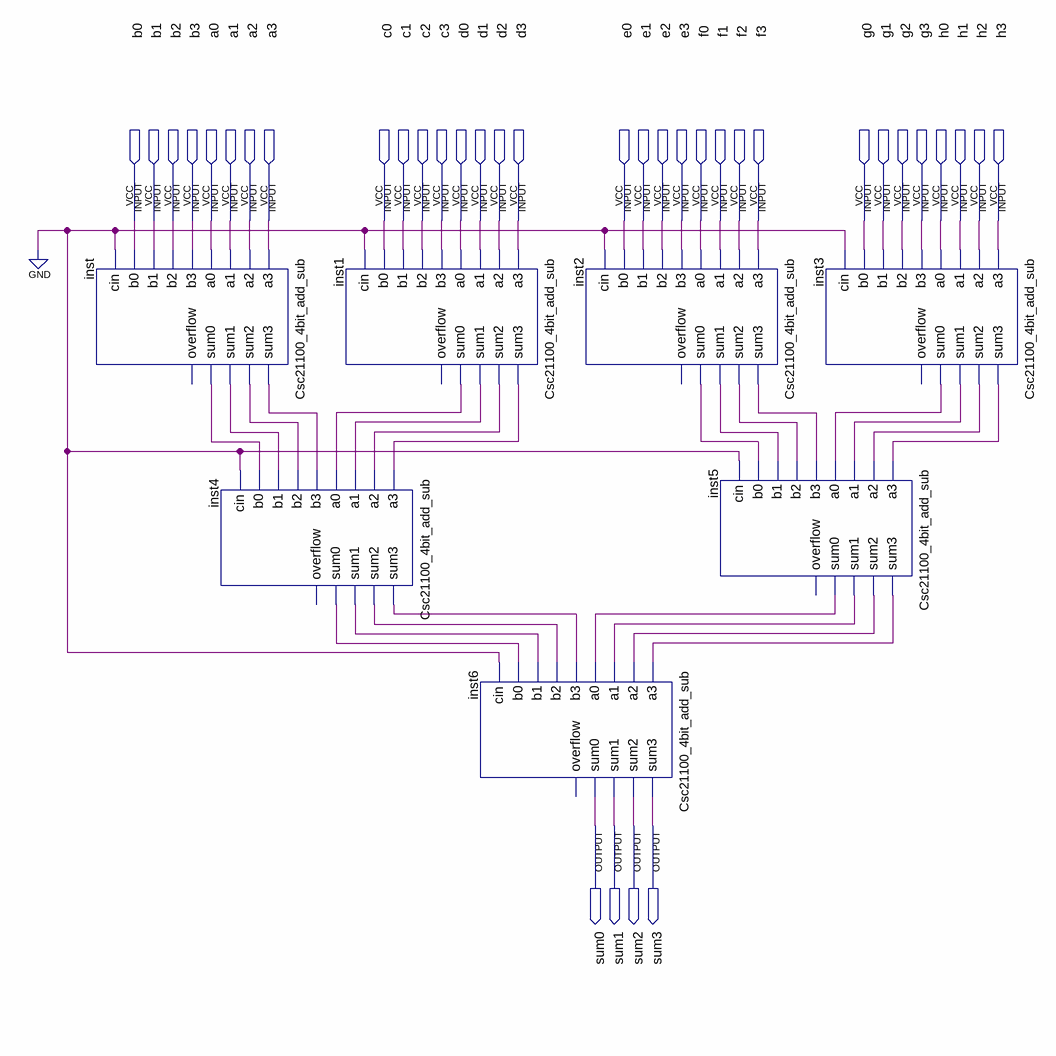
[diagram p0: schematic sheet]
// Quartus schematic Block1.bdf as structural Verilog: 7 symbols, 36 pins
module Block1 (
  input  b0,
  input  b1,
  input  b2,
  input  b3,
  input  a0,
  input  a1,
  input  a2,
  input  a3,
  input  c0,
  input  c1,
  input  c2,
  input  c3,
  input  d0,
  input  d1,
  input  d2,
  input  d3,
  input  e0,
  input  e1,
  input  e2,
  input  e3,
  input  f0,
  input  f1,
  input  f2,
  input  f3,
  input  g0,
  input  g1,
  input  g2,
  input  g3,
  input  h0,
  input  h1,
  input  h2,
  input  h3,
  output sum0,
  output sum1,
  output sum2,
  output sum3
);

  wire inst1_sum0, inst1_sum1, inst1_sum2, inst1_sum3, inst2_sum0, inst2_sum1, inst2_sum2, inst2_sum3,
       inst3_sum0, inst3_sum1, inst3_sum2, inst3_sum3, inst4_sum0, inst4_sum1, inst4_sum2, inst4_sum3,
       inst5_sum0, inst5_sum1, inst5_sum2, inst5_sum3, inst_sum0, inst_sum1, inst_sum2, inst_sum3;

  Csc21100_4bit_add_sub inst (
    .a3(a3), .a2(a2), .a1(a1), .a0(a0), .b3(b3), .b2(b2), .b1(b1), .b0(b0), .cin(1'b0), .sum3(inst_sum3),
    .sum2(inst_sum2), .sum1(inst_sum1), .sum0(inst_sum0));  // open: overflow
  Csc21100_4bit_add_sub inst4 (
    .a3(inst1_sum3), .a2(inst1_sum2), .a1(inst1_sum1), .a0(inst1_sum0), .b3(inst_sum3), .b2(inst_sum2),
    .b1(inst_sum1), .b0(inst_sum0), .cin(1'b0), .sum3(inst4_sum3), .sum2(inst4_sum2), .sum1(inst4_sum1),
    .sum0(inst4_sum0));  // open: overflow
  Csc21100_4bit_add_sub inst1 (
    .a3(d3), .a2(d2), .a1(d1), .a0(d0), .b3(c3), .b2(c2), .b1(c1), .b0(c0), .cin(1'b0), .sum3(inst1_sum3),
    .sum2(inst1_sum2), .sum1(inst1_sum1), .sum0(inst1_sum0));  // open: overflow
  Csc21100_4bit_add_sub inst6 (
    .a3(inst5_sum3), .a2(inst5_sum2), .a1(inst5_sum1), .a0(inst5_sum0), .b3(inst4_sum3), .b2(inst4_sum2),
    .b1(inst4_sum1), .b0(inst4_sum0), .cin(1'b0), .sum3(sum3), .sum2(sum2), .sum1(sum1), .sum0(sum0));  // open: overflow
  Csc21100_4bit_add_sub inst2 (
    .a3(f3), .a2(f2), .a1(f1), .a0(f0), .b3(e3), .b2(e2), .b1(e1), .b0(e0), .cin(1'b0), .sum3(inst2_sum3),
    .sum2(inst2_sum2), .sum1(inst2_sum1), .sum0(inst2_sum0));  // open: overflow
  Csc21100_4bit_add_sub inst5 (
    .a3(inst3_sum3), .a2(inst3_sum2), .a1(inst3_sum1), .a0(inst3_sum0), .b3(inst2_sum3), .b2(inst2_sum2),
    .b1(inst2_sum1), .b0(inst2_sum0), .cin(1'b0), .sum3(inst5_sum3), .sum2(inst5_sum2), .sum1(inst5_sum1),
    .sum0(inst5_sum0));  // open: overflow
  Csc21100_4bit_add_sub inst3 (
    .a3(h3), .a2(h2), .a1(h1), .a0(h0), .b3(g3), .b2(g2), .b1(g1), .b0(g0), .cin(1'b0), .sum3(inst3_sum3),
    .sum2(inst3_sum2), .sum1(inst3_sum1), .sum0(inst3_sum0));  // open: overflow
endmodule
